# Altium schematic sheet NegativeRegulator.SchDoc: Negative Regulator
size A4; SheetNumber: 2; SheetTotal: 3
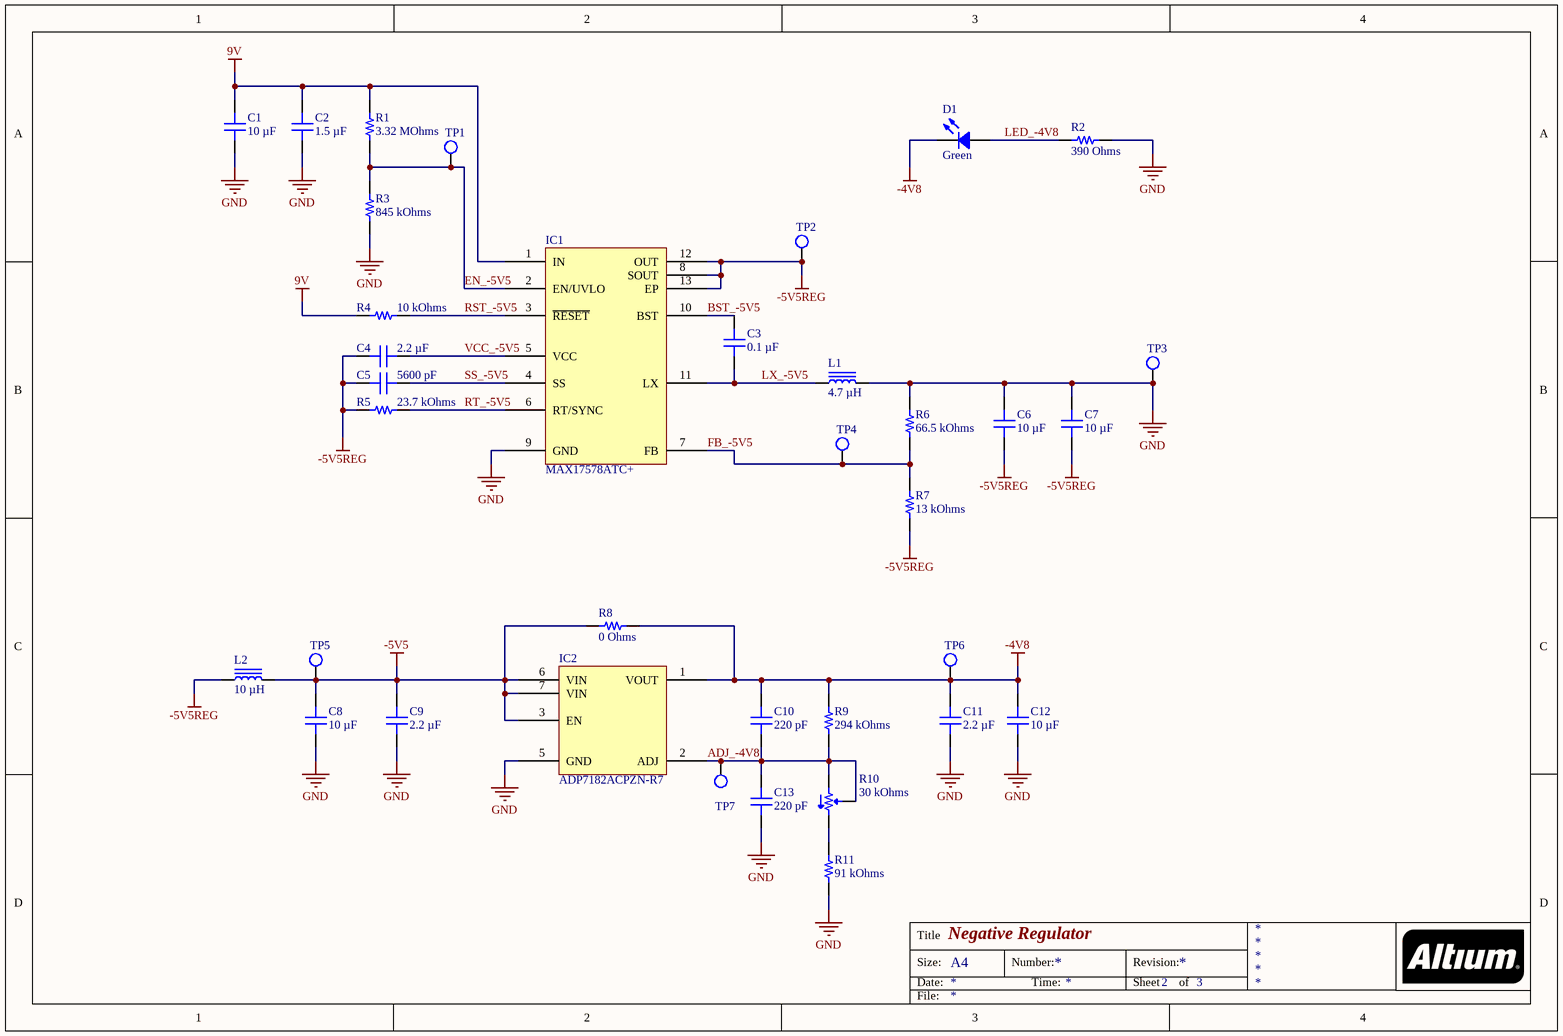
[diagram p0: NegativeRegulator.SchDoc]

## Parts
C1  10 µF  [CAP 1206_3216 - 0.8MM]
C2  1.5 µF  [CAP 1206_3216 - 0.8MM]
C3  0.1 µF  [CAP 0603_1608]
C4  2.2 µF  [CAP 0805_2012]
C5  5600 pF  [CAP 0603_1608]
C6  10 µF  [CAP 1206_3216 - 0.8MM]
C7  10 µF  [CAP 1206_3216 - 0.8MM]
C8  10 µF  [CAP 1206_3216 - 0.8MM]
C9  2.2 µF  [CAP 0805_2012]
C10  220 pF  [CAP 0603_1608]
C11  2.2 µF  [CAP 0805_2012]
C12  10 µF  [CAP 1206_3216 - 0.8MM]
C13  220 pF  [CAP 0603_1608]
D1  Green  [LED 0805_2012 GREEN]
IC1  MAX17578ATC+  [MAXIM TDFN-12 3X3MM TD1233+1]
IC2  ADP7182ACPZN-R7  [AD LFCSP-6 2X2MM CP-6-3]
L1  4.7 µH  [WURTH WE-HCI 7040]
L2  10 µH  [TAIYO YUDEN NR4018]
R1  3.32 MOhms  [RES 0603_1608]
R2  390 Ohms  [RES 0805_2012]
R3  845 kOhms  [RES 0603_1608]
R4  10 kOhms  [RES 0603_1608]
R5  23.7 kOhms  [RES 0603_1608]
R6  66.5 kOhms  [RES 0603_1608]
R7  13 kOhms  [RES 0603_1608]
R8  0 Ohms  [RES 0805_2012]
R9  294 kOhms  [RES 0603_1608]
R10  30 kOhms  [POT BOURNS TRIMPOT TC33]
R11  91 kOhms  [RES 0603_1608]
TP1  Test Point  [TestPoint-1.5mm]  (value not drawn)  (no BOM)
TP2  Test Point  [TestPoint-1.5mm]  (value not drawn)  (no BOM)
TP3  Test Point  [TestPoint-1.5mm]  (value not drawn)  (no BOM)
TP4  Test Point  [TestPoint-1.5mm]  (value not drawn)  (no BOM)
TP5  Test Point  [TestPoint-1.5mm]  (value not drawn)  (no BOM)
TP6  Test Point  [TestPoint-1.5mm]  (value not drawn)  (no BOM)
TP7  Test Point  [TestPoint-1.5mm]  (value not drawn)  (no BOM)

## Nets
9V: C1.2 C2.2 IC1.1(IN) R1.2 R4.1
-4V8: C10.2 C11.2 C12.2 D1.2 IC2.1(VOUT) R8.2 R9.2 TP6.1(TP)
-5V5: C8.2 C9.2 IC2.3(EN) IC2.6(VIN) IC2.7(VIN) L2.2 R8.1 TP5.1(TP)
-5V5REG: C4.1 C5.1 C6.1 C7.1 IC1.8(SOUT) IC1.12(OUT) IC1.13(EP) L2.1 R5.1 R7.1 TP2.1(TP)
GND: C1.1 C2.1 C6.2 C7.2 C8.1 C9.1 C11.1 C12.1 C13.1 IC1.9(GND) IC2.5(GND) L1.2 R2.2 R3.1 R6.2 R11.1 TP3.1(TP)
ADJ_-4V8: C10.1 C13.2 IC2.2(ADJ) R9.1 R10.1 R10.2 TP7.1(TP)
BST_-5V5: C3.2 IC1.10(BST)
EN_-5V5: IC1.2(EN/UVLO) R1.1 R3.2 TP1.1(TP)
FB_-5V5: IC1.7(FB) R6.1 R7.2 TP4.1(TP)
LED_-4V8: D1.1 R2.1
LX_-5V5: C3.1 IC1.11(LX) L1.1
RST_-5V5: IC1.3(~{RESET}) R4.2
RT_-5V5: IC1.6(RT/SYNC) R5.2
SS_-5V5: C5.2 IC1.4(SS)
VCC_-5V5: C4.2 IC1.5(VCC)
NetR10_3: R10.3 R11.2

## Notes on the sheet
- Title
- Size:
- Date:
- A4
- Number:
- Time:
- Revision:
- Sheet
- of
- File:

## Library data of the parts
C1 C6-C8 C12 = GMK316BJ106KL-T: CAP CER 10UF 35V X5R 1206; manufacturer: Taiyo Yuden; Tolerance: ±10%; Part Number: GMK316BJ106KL-T; Value: 10 µF; Applications: SMPS Filtering; Capacitance: 10 µF; componentlink1description: Datasheet; componentlink1url: https://www.yuden.co.jp/productdata/catalog/mlcc01_e.pdf; componentlink2description: DigiKey Link; componentlink2url: https://www.digikey.com/en/products/detail/taiyo-yuden/GMK316BJ106KL-T/2217972; Device Package: 1206 (3216 Metric); lastupdated: 19/06/2022 07:55:19; Lifecycle Status: Active; Minimum Order: 1; Mounting Type: Surface Mount, MLCC; Operating Temperature: -55°C ~ 85°C; Package / Case: 1206 (3216 Metric); packaging: TapeAndReel; partid: 41658; Part Status: Active; price: 0.07; series: M; Size / Dimension: 0.126" L x 0.063" W (3.20mm x 1.60mm); Supplier 1: DigiKey; Supplier Part Number 1: 587-2484-1-ND; Temperature Coefficient: X5R; Thickness (Max): 0.071" (1.80mm); Voltage - Rated: 35V
C2 = C1206C155K4RAC7800: CAP CER 1.5UF 16V X7R 1206; manufacturer: KEMET; Tolerance: ±10%; Part Number: C1206C155K4RAC7800; Value: 1.5 µF; Applications: Bypass, Decoupling; Capacitance: 1.5 µF; componentlink1description: Datasheet; componentlink1url: https://connect.kemet.com:7667/gateway/IntelliData-ComponentDocumentation/1.0/download/datasheet/C1206C155K4RACTU; componentlink2description: DigiKey Link; componentlink2url: https://www.digikey.com/en/products/detail/kemet/C1206C155K4RAC7800/2215304; Device Package: 1206 (3216 Metric); lastupdated: 19/06/2022 07:54:29; Lifecycle Status: Active; Minimum Order: 1; Mounting Type: Surface Mount, MLCC; Operating Temperature: -55°C ~ 125°C; Package / Case: 1206 (3216 Metric); packaging: TapeAndReel; partid: 41318; Part Status: Active; price: 0.08; series: SMD Comm X7R; Size / Dimension: 0.126" L x 0.063" W (3.20mm x 1.60mm); Supplier 1: DigiKey; Supplier Part Number 1: 399-C1206C155K4RAC7800CT-ND; Temperature Coefficient: X7R; Thickness (Max): 0.043" (1.10mm); Voltage - Rated: 16V
C3 = CL10B104KO8NNNC: CAP CER 0.1UF 16V X7R 0603; manufacturer: Samsung Electro-Mechanics; Tolerance: ±10%; Part Number: CL10B104KO8NNNC; Value: 0.1 µF; Applications: General Purpose; Capacitance: 0.1 µF; componentlink1description: Datasheet; componentlink1url: http://www.samsungsem.com/kr/support/product-search/mlcc/CL10B104KO8NNNC.jsp; componentlink2description: DigiKey Link; componentlink2url: https://www.digikey.com/en/products/detail/samsung-electro-mechanics/CL10B104KO8NNNC/3886663; Device Package: 0603 (1608 Metric); lastupdated: 19/06/2022 07:49:08; Lifecycle Status: Active; Minimum Order: 1; Mounting Type: Surface Mount, MLCC; Operating Temperature: -55°C ~ 125°C; Package / Case: 0603 (1608 Metric); packaging: TapeAndReel; partid: 9791; Part Status: Active; price: 0.01; series: CL; Size / Dimension: 0.063" L x 0.031" W (1.60mm x 0.80mm); Supplier 1: DigiKey; Supplier Part Number 1: 1276-1005-1-ND; Temperature Coefficient: X7R; Thickness (Max): 0.035" (0.90mm); Voltage - Rated: 16V
C4 C9 C11 = GRM21BR71E225KE11L: CAP CER 2.2UF 25V X7R 0805; manufacturer: Murata Electronics; Tolerance: ±10%; Part Number: GRM21BR71E225KE11L; Value: 2.2 µF; Applications: General Purpose; Capacitance: 2.2 µF; componentlink1description: Datasheet; componentlink1url: https://search.murata.co.jp/Ceramy/image/img/A01X/G101/ENG/GRM21BR71E225KE11-01.pdf; componentlink2description: DigiKey Link; componentlink2url: https://www.digikey.com/en/products/detail/murata-electronics/GRM21BR71E225KE11L/6606096; Device Package: 0805 (2012 Metric); lastupdated: 19/06/2022 07:52:39; Lifecycle Status: Active; Minimum Order: 1; Mounting Type: Surface Mount, MLCC; Operating Temperature: -55°C ~ 125°C; Package / Case: 0805 (2012 Metric); packaging: TapeAndReel; partid: 7355; Part Status: Active; price: 0.03; series: GRM; Size / Dimension: 0.079" L x 0.049" W (2.00mm x 1.25mm); Supplier 1: DigiKey; Supplier Part Number 1: 490-14467-1-ND; Temperature Coefficient: X7R; Thickness (Max): 0.055" (1.40mm); Voltage - Rated: 25V
C5 = C0603C562K5RAC7867: CAP CER 5600PF 50V X7R 0603; manufacturer: KEMET; Tolerance: ±10%; Part Number: C0603C562K5RAC7867; Value: 5600 pF; Applications: Bypass, Decoupling; Capacitance: 5600 pF; componentlink1description: Datasheet; componentlink1url: https://api.kemet.com/component-edge/download/datasheet/C0603C562K5RACTU.pdf; componentlink2description: DigiKey Link; componentlink2url: https://www.digikey.com/en/products/detail/kemet/C0603C562K5RAC7867/2201004; Device Package: 0603 (1608 Metric); lastupdated: 19/06/2022 07:48:25; Lifecycle Status: Active; Minimum Order: 1; Mounting Type: Surface Mount, MLCC; Operating Temperature: -55°C ~ 125°C; Package / Case: 0603 (1608 Metric); packaging: TapeAndReel; partid: 35437; Part Status: Active; price: 0.01; series: SMD Comm X7R; Size / Dimension: 0.063" L x 0.031" W (1.60mm x 0.80mm); Supplier 1: DigiKey; Supplier Part Number 1: 399-C0603C562K5RAC7867CT-ND; Temperature Coefficient: X7R; Thickness (Max): 0.034" (0.87mm); Voltage - Rated: 50V
C10 C13 = CC0603JRNPO8BN221: CAP CER 220PF 25V C0G/NPO 0603; manufacturer: Yageo; Temperature Coefficient: C0G, NP0; Tolerance: ±5%; Part Number: CC0603JRNPO8BN221; Value: 220 pF; Applications: General Purpose; Capacitance: 220 pF; componentlink1description: Datasheet; componentlink1url: https://www.yageo.com/upload/media/product/productsearch/datasheet/mlcc/UPY-GP_NP0_16V-to-50V_17.pdf; componentlink2description: DigiKey Link; componentlink2url: https://www.digikey.com/en/products/detail/yageo/CC0603JRNPO8BN221/5883593; Device Package: 0603 (1608 Metric); lastupdated: 19/06/2022 07:49:09; Lifecycle Status: Active; Minimum Order: 1; Mounting Type: Surface Mount, MLCC; Operating Temperature: -55°C ~ 125°C; Package / Case: 0603 (1608 Metric); packaging: TapeAndReel; partid: 9530; Part Status: Active; price: 0.01; series: CC; Size / Dimension: 0.063" L x 0.031" W (1.60mm x 0.80mm); Supplier 1: DigiKey; Supplier Part Number 1: 311-3953-1-ND; Thickness (Max): 0.035" (0.90mm); Voltage - Rated: 25V
D1 = APHCM2012CGCK-F01: LED GREEN CLEAR CHIP SMD; Manufacturer: Kingbright; Configuration: Standard; Current - Test: 20mA; Lens Color: Colorless; Lens Size: 1.30mm x 1.25mm; Lens Style: Rectangle with Flat Top; Millicandela Rating: 50mcd; Viewing Angle: 110°; Voltage - Forward (Vf) (Typ): 2.1V; Wavelength - Dominant: 570nm; Wavelength - Peak: 574nm; Part Number: APHCM2012CGCK-F01; Color: Green; ComponentLink1Description: Datasheet; ComponentLink1URL: http://www.kingbrightusa.com/images/catalog/SPEC/APHCM2012CGCK-F01.pdf; ComponentLink2Description: DigiKey Link; ComponentLink2URL: https://www.digikey.com/en/products/detail/kingbright/APHCM2012CGCK-F01/1747492; Device Package: 0805 (2012 Metric); Height (Max): 0.40mm; LastUpdated: 20/06/2022 12:31:45; Lens Transparency: Clear; Lifecycle Status: Active; Minimum Order: 1; Mounting Type: Surface Mount; Package / Case: 0805 (2012 Metric); Packaging: TapeAndReel; PartId: 241; Part Status: Active; Price: 0.06; Series: -; Size / Dimension: 2.00mm L x 1.25mm W; Supplier 1: DigiKey; Supplier Part Number 1: 754-1094-1-ND; Supplier Device Package: Chip LED; Value: Green
IC1 = MAX17578ATC+: 4.5V TO 60V, 1A HIGH-EFFICIENCY,; Manufacturer: Analog Devices Inc./Maxim Integrated; Frequency - Switching: 400kHz ~ 2.2MHz; Function: Ratiometric; Number of Outputs: 1; Output Configuration: Negative; Output Type: Adjustable; Synchronous Rectifier: Yes; Topology: Buck; Voltage - Input (Max): 24V; Voltage - Output (Max): -36V; Voltage - Output (Min/Fixed): -0.9V; Part Number: MAX17578ATC+; ComponentLink1Description: Datasheet; ComponentLink1URL: https://datasheets.maximintegrated.com/en/ds/MAX17577-MAX17578.pdf; ComponentLink2Description: DigiKey Link; ComponentLink2URL: https://www.digikey.com/en/products/detail/analog-devices-inc-maxim-integrated/MAX17578ATC/13592869; Current - Output: 1A; LastUpdated: 20/06/2022 10:51:56; Lifecycle Status: Active; Minimum Order: 1; Mounting Type: Surface Mount; Operating Temperature: -40°C ~ 125°C (TA); Packaging: Tray; Part Status: Active; Price: 2.51; Series: Himalaya; Supplier 1: DigiKey; Supplier Part Number 1: 175-MAX17578ATC+-ND; Supplier Device Package: 12-TDFN (3x3); Voltage - Input (Min): 4.5V
IC2 = ADP7182ACPZN-R7: IC REG LIN NEG ADJ 200MA 6LFCSP; Manufacturer: Analog Devices Inc.; Control Features: Enable; Current - Quiescent (Iq): 53 µA; Current - Supply (Max): 850 µA; Number of Regulators: 1; Output Configuration: Negative; Output Type: Adjustable; Protection Features: Over Current, Over Temperature; PSRR: 66dB ~ 45dB (10kHz ~ 1MHz); Voltage Dropout (Max): 0.36V @ 200mA; Voltage - Input (Max): -28V; Voltage - Output (Max): -27.64V; Voltage - Output (Min/Fixed): -1.22V; Part Number: ADP7182ACPZN-R7; ComponentLink1Description: Datasheet; ComponentLink1URL: https://www.analog.com/media/en/technical-documentation/data-sheets/ADP7182.pdf; ComponentLink2Description: DigiKey Link; ComponentLink2URL: https://www.digikey.com/en/products/detail/analog-devices-inc/ADP7182ACPZN-R7/5011553; Current - Output: 200mA; LastUpdated: 16/06/2022 08:45:05; Lifecycle Status: Active; Minimum Order: 1; Mounting Type: Surface Mount; Operating Temperature: -40°C ~ 125°C; Package / Case: 6-UDFN Exposed Pad; Packaging: TapeAndReel; Part Status: Active; Price: 2.56; Series: -; Supplier 1: DigiKey; Supplier Part Number 1: 505-ADP7182ACPZN-R7CT-ND; Supplier Device Package: 6-LFCSP-UD (2x2)
L1 = 744311470: FIXED IND 4.7UH 6A 19.5 MOHM SMD; Manufacturer: Würth Elektronik; Current - Saturation: 7A; Frequency - Self Resonant: 33MHz; Inductance Frequency - Test: 100 kHz; Material - Core: Nonstandard; Shielding: Shielded; Tolerance: ±20%; Type: Wirewound; Part Number: 744311470; ComponentLink1Description: Datasheet; ComponentLink1URL: https://katalog.we-online.de/pbs/datasheet/744311470.pdf; ComponentLink2Description: DigiKey Link; ComponentLink2URL: https://www.digikey.com/en/products/detail/würth-elektronik/744311470/1638558; Current Rating (Amps): 6 A; DC Resistance (DCR): 19.5mOhm; Device Package: Nonstandard; Height - Seated (Max): 0.157" (4.00mm); Inductance: 4.7 µH; LastUpdated: 19/06/2022 08:35:18; Lifecycle Status: Active; Minimum Order: 1; Mounting Type: Surface Mount; Operating Temperature: -40°C ~ 150°C; Package / Case: Nonstandard; Packaging: TapeAndReel; PartId: 258; Part Status: Active; Price: 2.72; Ratings: AEC-Q200; Series: WE-HCI; Size / Dimension: 0.276" L x 0.272" W (7.00mm x 6.90mm); Supplier 1: DigiKey; Supplier Part Number 1: 732-1153-1-ND; Supplier Device Package: 7040; Value: 4.7 µH
L2 = NR4018T100M: FIXED IND 10UH 840MA 216MOHM SMD; Manufacturer: Taiyo Yuden; Current - Saturation: 1.2A; DC Resistance (DCR): 216mOhm Max; Frequency - Self Resonant: 24MHz; Inductance Frequency - Test: 100 kHz; Material - Core: Ferrite; Shielding: Shielded; Tolerance: ±20%; Type: Drum Core, Wirewound; Part Number: NR4018T100M; ComponentLink1Description: Datasheet; ComponentLink1URL: https://www.yuden.co.jp/productdata/catalog/wound04_e.pdf; ComponentLink2Description: DigiKey Link; ComponentLink2URL: https://www.digikey.com/en/products/detail/taiyo-yuden/NR4018T100M/958047; Current Rating (Amps): 840 mA; Device Package: Nonstandard; Height - Seated (Max): 0.071" (1.80mm); Inductance: 10 µH; LastUpdated: 19/06/2022 08:48:28; Lifecycle Status: Active; Minimum Order: 1; Mounting Type: Surface Mount; Operating Temperature: -25°C ~ 120°C; Package / Case: Nonstandard; Packaging: TapeAndReel; PartId: 3644; Part Status: Active; Price: 0.14; Series: NR; Size / Dimension: 0.157" L x 0.157" W (4.00mm x 4.00mm); Supplier 1: DigiKey; Supplier Part Number 1: 587-1664-1-ND; Value: 10 µH
R1 = RC0603FR-073M32L: RES 3.32M OHM 1% 1/10W 0603; Manufacturer: Yageo; Power (Watts): 0.1W, 1/10W; Temperature Coefficient: ±100ppm/°C; Part Number: RC0603FR-073M32L; Value: 3.32 MOhms; ComponentLink1Description: Datasheet; ComponentLink1URL: https://www.yageo.com/upload/media/product/productsearch/datasheet/rchip/PYu-RC_Group_51_RoHS_L_11.pdf; ComponentLink2Description: DigiKey Link; ComponentLink2URL: https://www.digikey.com/en/products/detail/yageo/RC0603FR-073M32L/5918333; Composition: Thick Film; Device Package: 0603 (1608 Metric); Features: Moisture Resistant; Height - Seated (Max): 0.022" (0.55mm); LastUpdated: 19/06/2022 08:07:05; Lifecycle Status: Active; Minimum Order: 1; Number of Terminations: 2; Operating Temperature: -55°C ~ 155°C; Package / Case: 0603 (1608 Metric); Packaging: CutTape; PartId: 62044; Part Status: Active; Price: 0.01; Resistance: 3.32 MOhms; Series: RC_L; Size / Dimension: 0.063" L x 0.031" W (1.60mm x 0.80mm); Supplier 1: DigiKey; Supplier Part Number 1: 13-RC0603FR-073M32LCT-ND; Supplier Device Package: 0603; Tolerance: ±1%
R2 = CRG0805F390R: RES SMD 390 OHM 1% 1/8W 0805; Manufacturer: TE Connectivity Passive Product; Power (Watts): 0.125W, 1/8W; Temperature Coefficient: ±100ppm/°C; Part Number: CRG0805F390R; Value: 390 Ohms; ComponentLink1Description: Datasheet; ComponentLink1URL: https://www.te.com/commerce/DocumentDelivery/DDEController?Action=srchrtrv&DocNm=1773204&DocType=DS&DocLang=English; ComponentLink2Description: DigiKey Link; ComponentLink2URL: https://www.digikey.com/en/products/detail/te-connectivity-passive-product/CRG0805F390R/2380897; Composition: Thick Film; Device Package: 0805 (2012 Metric); Height - Seated (Max): 0.026" (0.65mm); LastUpdated: 20/06/2022 12:21:16; Lifecycle Status: Active; Minimum Order: 1; Number of Terminations: 2; Operating Temperature: -55°C ~ 155°C; Package / Case: 0805 (2012 Metric); Packaging: TapeAndReel; PartId: 46128; Part Status: Active; Price: 0.01; Resistance: 390 Ohms; Series: CRG, Neohm; Size / Dimension: 0.079" L x 0.049" W (2.00mm x 1.25mm); Supplier 1: DigiKey; Supplier Part Number 1: A126365CT-ND; Supplier Device Package: 0805; Tolerance: ±1%
R3 = RC0603FR-07845KL: RES 845K OHM 1% 1/10W 0603; Manufacturer: Yageo; Power (Watts): 0.1W, 1/10W; Temperature Coefficient: ±100ppm/°C; Part Number: RC0603FR-07845KL; Value: 845 kOhms; ComponentLink1Description: Datasheet; ComponentLink1URL: https://www.yageo.com/upload/media/product/productsearch/datasheet/rchip/PYu-RC_Group_51_RoHS_L_10.pdf; ComponentLink2Description: DigiKey Link; ComponentLink2URL: https://www.digikey.com/en/products/detail/yageo/RC0603FR-07845KL/727410; Composition: Thick Film; Device Package: 0603 (1608 Metric); Features: Moisture Resistant; Height - Seated (Max): 0.022" (0.55mm); LastUpdated: 19/06/2022 08:07:49; Lifecycle Status: Active; Minimum Order: 1; Number of Terminations: 2; Operating Temperature: -55°C ~ 155°C; Package / Case: 0603 (1608 Metric); Packaging: CutTape; PartId: 22882; Part Status: Active; Price: 0.01; Resistance: 845 kOhms; Series: RC_L; Size / Dimension: 0.063" L x 0.031" W (1.60mm x 0.80mm); Supplier 1: DigiKey; Supplier Part Number 1: 311-845KHRCT-ND; Supplier Device Package: 0603; Tolerance: ±1%
R4 = RC0603FR-0710KL: RES 10K OHM 1% 1/10W 0603; Manufacturer: Yageo; Power (Watts): 0.1W, 1/10W; Temperature Coefficient: ±100ppm/°C; Part Number: RC0603FR-0710KL; Value: 10 kOhms; ComponentLink1Description: Datasheet; ComponentLink1URL: https://www.yageo.com/upload/media/product/productsearch/datasheet/rchip/PYu-RC_Group_51_RoHS_L_10.pdf; ComponentLink2Description: DigiKey Link; ComponentLink2URL: https://www.digikey.com/en/products/detail/yageo/RC0603FR-0710KL/726880; Composition: Thick Film; Device Package: 0603 (1608 Metric); Features: Moisture Resistant; Height - Seated (Max): 0.022" (0.55mm); LastUpdated: 19/06/2022 08:07:51; Lifecycle Status: Active; Minimum Order: 1; Number of Terminations: 2; Operating Temperature: -55°C ~ 155°C; Package / Case: 0603 (1608 Metric); Packaging: CutTape; PartId: 22599; Part Status: Active; Price: 0.01; Resistance: 10 kOhms; Series: RC_L; Size / Dimension: 0.063" L x 0.031" W (1.60mm x 0.80mm); Supplier 1: DigiKey; Supplier Part Number 1: 311-10.0KHRCT-ND; Supplier Device Package: 0603; Tolerance: ±1%
R5 = RC0603FR-0723K7L: RES 23.7K OHM 1% 1/10W 0603; Manufacturer: Yageo; Power (Watts): 0.1W, 1/10W; Temperature Coefficient: ±100ppm/°C; Part Number: RC0603FR-0723K7L; Value: 23.7 kOhms; ComponentLink1Description: Datasheet; ComponentLink1URL: https://www.yageo.com/upload/media/product/productsearch/datasheet/rchip/PYu-RC_Group_51_RoHS_L_10.pdf; ComponentLink2Description: DigiKey Link; ComponentLink2URL: https://www.digikey.com/en/products/detail/yageo/RC0603FR-0723K7L/727070; Composition: Thick Film; Device Package: 0603 (1608 Metric); Features: Moisture Resistant; Height - Seated (Max): 0.022" (0.55mm); LastUpdated: 19/06/2022 08:08:17; Lifecycle Status: Active; Minimum Order: 1; Number of Terminations: 2; Operating Temperature: -55°C ~ 155°C; Package / Case: 0603 (1608 Metric); Packaging: CutTape; PartId: 12444; Part Status: Active; Price: 0.01; Resistance: 23.7 kOhms; Series: RC_L; Size / Dimension: 0.063" L x 0.031" W (1.60mm x 0.80mm); Supplier 1: DigiKey; Supplier Part Number 1: 311-23.7KHRCT-ND; Supplier Device Package: 0603; Tolerance: ±1%
R6 = ERJ-3EKF6652V: RES SMD 66.5K OHM 1% 1/10W 0603; Manufacturer: Panasonic Electronic Components; Power (Watts): 0.1W, 1/10W; Temperature Coefficient: ±100ppm/°C; Part Number: ERJ-3EKF6652V; Value: 66.5 kOhms; ComponentLink1Description: Datasheet; ComponentLink1URL: https://industrial.panasonic.com/cdbs/www-data/pdf/RDA0000/AOA0000C304.pdf; ComponentLink2Description: DigiKey Link; ComponentLink2URL: https://www.digikey.com/en/products/detail/panasonic-electronic-components/ERJ-3EKF6652V/196444; Composition: Thick Film; Device Package: 0603 (1608 Metric); Features: Automotive AEC-Q200; Height - Seated (Max): 0.022" (0.55mm); LastUpdated: 19/06/2022 08:07:29; Lifecycle Status: Active; Minimum Order: 1; Number of Terminations: 2; Operating Temperature: -55°C ~ 155°C; Package / Case: 0603 (1608 Metric); Packaging: TapeAndReel; PartId: 26116; Part Status: Active; Price: 0.01; Ratings: AEC-Q200; Resistance: 66.5 kOhms; Series: ERJ-3EK; Size / Dimension: 0.063" L x 0.031" W (1.60mm x 0.80mm); Supplier 1: DigiKey; Supplier Part Number 1: P66.5KHCT-ND; Supplier Device Package: 0603; Tolerance: ±1%
R7 = ERJ-3GEYJ133V: RES SMD 13K OHM 5% 1/10W 0603; Manufacturer: Panasonic Electronic Components; Power (Watts): 0.1W, 1/10W; Temperature Coefficient: ±200ppm/°C; Part Number: ERJ-3GEYJ133V; Value: 13 kOhms; ComponentLink1Description: Datasheet; ComponentLink1URL: http://industrial.panasonic.com/www-cgi/jvcr13pz.cgi?E+PZ+3+AOA0001+ERJ3GEYJ133V+7+WW; ComponentLink2Description: DigiKey Link; ComponentLink2URL: https://www.digikey.com/en/products/detail/panasonic-electronic-components/ERJ-3GEYJ133V/135680; Composition: Thick Film; Device Package: 0603 (1608 Metric); Features: Automotive AEC-Q200; Height - Seated (Max): 0.022" (0.55mm); LastUpdated: 19/06/2022 08:08:01; Lifecycle Status: Active; Minimum Order: 1; Number of Terminations: 2; Operating Temperature: -55°C ~ 155°C; Package / Case: 0603 (1608 Metric); Packaging: TapeAndReel; PartId: 19318; Part Status: Active; Price: 0.01; Ratings: AEC-Q200; Resistance: 13 kOhms; Series: ERJ-3G; Size / Dimension: 0.063" L x 0.031" W (1.60mm x 0.80mm); Supplier 1: DigiKey; Supplier Part Number 1: P13KGCT-ND; Supplier Device Package: 0603; Tolerance: ±5%
R8 = RC0805JR-7W0RL: RES 0 OHM JUMPER 1/4W 0805; Manufacturer: Yageo; Power (Watts): 0.25W, 1/4W; Part Number: RC0805JR-7W0RL; Value: 0 Ohms; ComponentLink1Description: Datasheet; ComponentLink1URL: https://www.yageo.com/upload/media/product/productsearch/datasheet/rchip/PYu-RC_Group_51_RoHS_L_11.pdf; ComponentLink2Description: DigiKey Link; ComponentLink2URL: https://www.digikey.com/en/products/detail/yageo/RC0805JR-7W0RL/12698815; Composition: Thick Film; Device Package: 0805 (2012 Metric); Features: Moisture Resistant; Height - Seated (Max): 0.024" (0.60mm); LastUpdated: 20/06/2022 12:20:32; Lifecycle Status: Active; Minimum Order: 1; Number of Terminations: 2; Operating Temperature: -55°C ~ 155°C; Package / Case: 0805 (2012 Metric); Packaging: TapeAndReel; PartId: 67008; Part Status: Active; Price: 0.01; Resistance: 0 Ohms; Series: RC_L; Size / Dimension: 0.079" L x 0.049" W (2.00mm x 1.25mm); Supplier 1: DigiKey; Supplier Part Number 1: 13-RC0805JR-7W0RLCT-ND; Supplier Device Package: 0805; Tolerance: Jumper
R9 = ERA-3AEB2943V: RES SMD 294K OHM 0.1% 1/10W 0603; Manufacturer: Panasonic Electronic Components; Power (Watts): 0.1W, 1/10W; Temperature Coefficient: ±25ppm/°C; Part Number: ERA-3AEB2943V; Value: 294 kOhms; ComponentLink1Description: Datasheet; ComponentLink1URL: https://industrial.panasonic.com/cdbs/www-data/pdf/RDM0000/AOA0000C307.pdf; ComponentLink2Description: DigiKey Link; ComponentLink2URL: https://www.digikey.com/en/products/detail/panasonic-electronic-components/ERA-3AEB2943V/2026969; Composition: Thin Film; Device Package: 0603 (1608 Metric); Features: Automotive AEC-Q200; Height - Seated (Max): 0.022" (0.55mm); LastUpdated: 19/06/2022 08:07:50; Lifecycle Status: Active; Minimum Order: 1; Number of Terminations: 2; Operating Temperature: -55°C ~ 155°C; Package / Case: 0603 (1608 Metric); Packaging: TapeAndReel; PartId: 22652; Part Status: Active; Price: 0.04; Ratings: AEC-Q200; Resistance: 294 kOhms; Series: ERA-3A; Size / Dimension: 0.063" L x 0.031" W (1.60mm x 0.80mm); Supplier 1: DigiKey; Supplier Part Number 1: P294KDBCT-ND; Supplier Device Package: 0603; Tolerance: ±0.1%
R10 = TC33X-2-303E: TRIMMER 30K OHM 0.1W J LEAD TOP; Manufacturer: Bourns Inc.; Adjustment Type: Top Adjustment; Number of Turns: 1; Power (Watts): 0.1W, 1/10W; Resistive Material: Cermet; Temperature Coefficient: ±250ppm/°C; Tolerance: ±25%; Part Number: TC33X-2-303E; ComponentLink1Description: Datasheet; ComponentLink1URL: https://www.bourns.com/docs/Product-Datasheets/TC33.pdf; ComponentLink2Description: DigiKey Link; ComponentLink2URL: https://www.digikey.com/en/products/detail/bourns-inc/TC33X-2-303E/2566895; LastUpdated: 20/06/2022 12:32:03; Lifecycle Status: Active; Minimum Order: 1; Mounting Type: Surface Mount; Packaging: TapeAndReel; PartId: 15; Part Status: Active; Price: 0.11; Resistance: 30 kOhms; Series: Trimpot® TC33 - Open Frame; Size / Dimension: Rectangular - 0.150" x 0.142" Face x 0.047" H (3.80mm x 3.60mm x 1.20mm); Supplier 1: DigiKey; Supplier Part Number 1: TC33X-2-303ECT-ND; Termination Style: J Lead; Value: 30 kOhms
R11 = RC0603FR-0791KL: RES 91K OHM 1% 1/10W 0603; Manufacturer: Yageo; Power (Watts): 0.1W, 1/10W; Temperature Coefficient: ±100ppm/°C; Part Number: RC0603FR-0791KL; Value: 91 kOhms; ComponentLink1Description: Datasheet; ComponentLink1URL: https://www.yageo.com/upload/media/product/productsearch/datasheet/rchip/PYu-RC_Group_51_RoHS_L_10.pdf; ComponentLink2Description: DigiKey Link; ComponentLink2URL: https://www.digikey.com/en/products/detail/yageo/RC0603FR-0791KL/727428; Composition: Thick Film; Device Package: 0603 (1608 Metric); Features: Moisture Resistant; Height - Seated (Max): 0.022" (0.55mm); LastUpdated: 20/06/2022 12:10:33; Lifecycle Status: Active; Minimum Order: 1; Number of Terminations: 2; Operating Temperature: -55°C ~ 155°C; Package / Case: 0603 (1608 Metric); Packaging: CutTape; PartId: 7596; Part Status: Active; Price: 0.01; Resistance: 91 kOhms; Series: RC_L; Size / Dimension: 0.063" L x 0.031" W (1.60mm x 0.80mm); Supplier 1: DigiKey; Supplier Part Number 1: 311-91.0KHRCT-ND; Supplier Device Package: 0603; Tolerance: ±1%
TP1-TP7 = CMP-003-000000-1: Component Type: Standard (No BOM); Source: Test Point.SchLib; Design Item ID: Test Point; Pin Count: 1